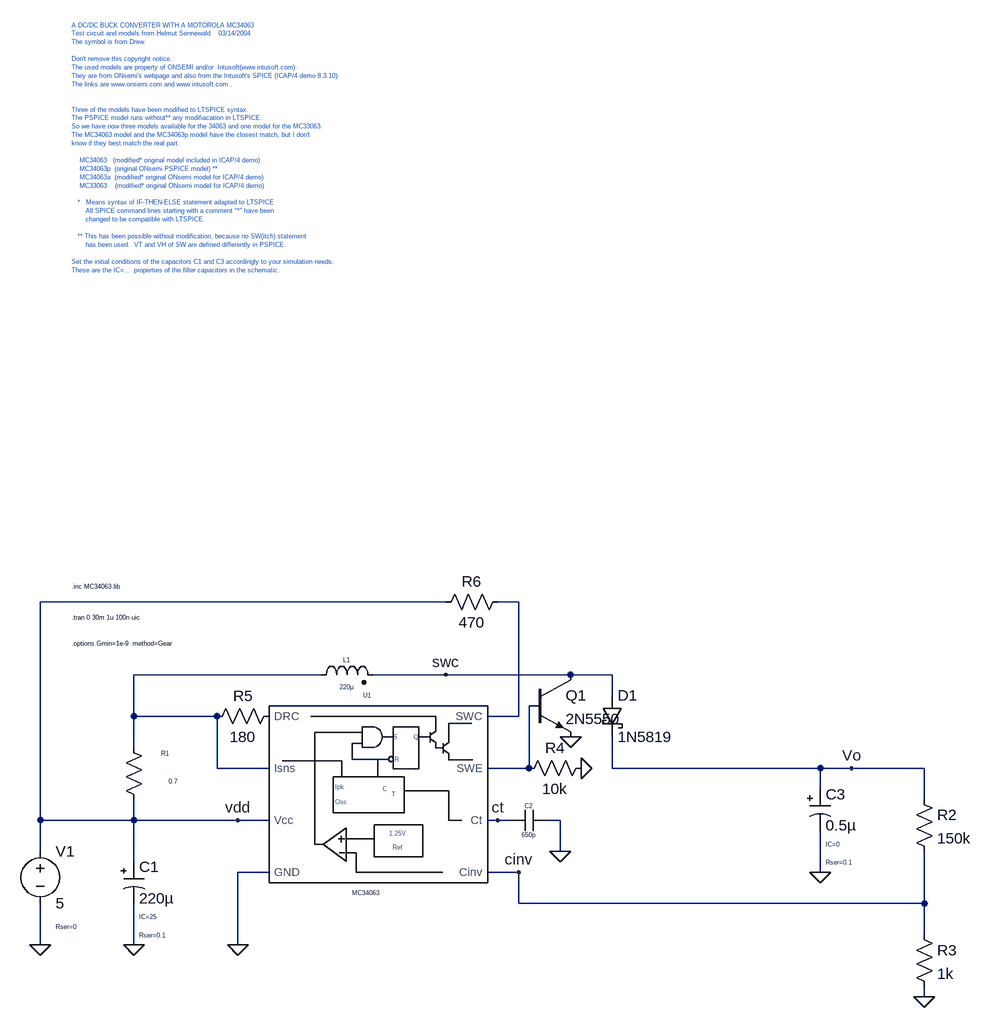
[diagram p0: schematic MC34063_buck.asc]
MC34063_buck.asc, the LTspice schematic file:
Version 4
SHEET 1 1572 772
WIRE 208 -48 -416 -48
WIRE 320 -48 288 -48
WIRE 16 64 -272 64
WIRE 208 64 96 64
WIRE 400 64 208 64
WIRE 464 64 400 64
WIRE 464 96 464 64
WIRE -272 128 -272 64
WIRE -144 128 -272 128
WIRE 320 128 320 -48
WIRE 320 128 272 128
WIRE -272 176 -272 128
WIRE -144 208 -144 128
WIRE -64 208 -144 208
WIRE 336 208 336 112
WIRE 336 208 272 208
WIRE 464 208 464 160
WIRE 784 208 464 208
WIRE 832 208 784 208
WIRE 944 208 832 208
WIRE 784 240 784 208
WIRE 944 256 944 208
WIRE -416 288 -416 -48
WIRE -272 288 -272 256
WIRE -272 288 -416 288
WIRE -112 288 -272 288
WIRE -64 288 -112 288
WIRE 288 288 272 288
WIRE 304 288 288 288
WIRE 384 288 368 288
WIRE -416 336 -416 288
WIRE 384 336 384 288
WIRE -272 352 -272 288
WIRE -64 368 -112 368
WIRE 320 368 272 368
WIRE 784 368 784 304
WIRE 320 416 320 368
WIRE 944 416 944 336
WIRE 944 416 320 416
WIRE 944 464 944 416
WIRE -416 480 -416 416
WIRE -272 480 -272 416
WIRE -112 480 -112 368
WIRE 944 560 944 544
FLAG -416 480 0
FLAG -272 480 0
FLAG 384 336 0
FLAG 784 368 0
FLAG 832 208 Vo
FLAG 944 560 0
FLAG -112 480 0
FLAG 288 288 ct
FLAG -112 288 vdd
FLAG 320 368 cinv
FLAG 208 64 swc
FLAG 400 160 0
FLAG 416 208 0
SYMBOL voltage -416 320 R0
WINDOW 123 0 0 Left 0
WINDOW 39 24 132 Left 0
SYMATTR SpiceLine Rser=0
SYMATTR InstName V1
SYMATTR Value 5
SYMBOL res -256 272 R180
WINDOW 0 -39 87 Left 0
WINDOW 3 -52 44 Left 0
SYMATTR InstName R1
SYMATTR Value 0.7
SYMBOL cap 304 304 R270
WINDOW 0 32 32 VTop 0
WINDOW 3 0 32 VBottom 0
SYMATTR InstName C2
SYMATTR Value 650p
SYMBOL schottky 448 96 R0
SYMATTR InstName D1
SYMATTR Value 1N5819
SYMATTR Description Diode
SYMATTR Type diode
SYMBOL ind2 0 80 R270
WINDOW 0 32 56 VTop 0
WINDOW 3 4 56 VBottom 0
SYMATTR InstName L1
SYMATTR Value 220µ
SYMATTR SpiceLine Rser=0.5
SYMATTR Type ind
SYMBOL res 928 240 R0
SYMATTR InstName R2
SYMATTR Value 150k
SYMBOL res 928 448 R0
SYMATTR InstName R3
SYMATTR Value 1k
SYMBOL polcap 768 240 R0
WINDOW 39 24 113 Left 0
WINDOW 40 24 85 Left 0
SYMATTR SpiceLine Rser=0.1
SYMATTR SpiceLine2 IC=0
SYMATTR InstName C3
SYMATTR Value 0.5µ
SYMBOL polcap -288 352 R0
WINDOW 39 24 113 Left 0
WINDOW 40 24 85 Left 0
SYMATTR SpiceLine Rser=0.1
SYMATTR SpiceLine2 IC=25
SYMATTR InstName C1
SYMATTR Value 220µ
SYMBOL mc34063 176 224 R0
SYMATTR InstName U1
SYMBOL res -48 112 R90
WINDOW 0 0 56 VBottom 2
WINDOW 3 32 56 VTop 2
SYMATTR InstName R5
SYMATTR Value 180
SYMBOL res 304 -64 R90
WINDOW 0 0 56 VBottom 2
WINDOW 3 32 56 VTop 2
SYMATTR InstName R6
SYMATTR Value 470
SYMBOL npn 336 64 R0
SYMATTR InstName Q1
SYMATTR Value 2N5550
SYMBOL res 432 192 R90
WINDOW 0 0 56 VBottom 2
WINDOW 3 32 56 VTop 2
SYMATTR InstName R4
SYMATTR Value 10k
TEXT -368 -24 Left 0 !.tran 0 30m 1u 100n uic
TEXT -368 -72 Left 0 !.inc MC34063.lib
TEXT -368 16 Left 0 !.options Gmin=1e-9  method=Gear
TEXT -368 -936 Left 0 ;A DC/DC BUCK CONVERTER WITH A MOTOROLA MC34063\nTest circuit and models from Helmut Sennewald    03/14/2004\nThe symbol is from Drew.\n \nDon't remove this copyright notice.\nThe used models are property of ONSEMI and/or  Intusoft(www.intusoft.com).\nThey are from ONsemi's webpage and also from the Intusoft's SPICE (ICAP/4 demo 8.3.10).\nThe links are www.onsemi.com and www.intusoft.com .\n \n \nThree of the models have been modified to LTSPICE syntax.\nThe PSPICE model runs without** any modifiacation in LTSPICE.\nSo we have now three models available for the 34063 and one model for the MC33063. \nThe MC34063 model and the MC34063p model have the closest match, but I don't\nknow if they best match the real part.\n \n    MC34063   (modified* original model included in ICAP/4 demo)\n    MC34063p  (original ONsemi PSPICE model) **\n    MC34063a  (modified* original ONsemi model for ICAP/4 demo)\n    MC33063    (modified* original ONsemi model for ICAP/4 demo) \n \n   *   Means syntax of IF-THEN-ELSE statement adapted to LTSPICE\n       All SPICE command lines starting with a comment "*" have been \n       changed to be compatible with LTSPICE. \n      \n   ** This has been possible without modification, because no SW(itch) statement \n       has been used.  VT and VH of SW are defined differently in PSPICE.\n \nSet the initial conditions of the capacitors C1 and C3 accordingly to your simulation needs.\nThese are the IC=...  properties of the filter capacitors in the schematic.

The netlist it stands for:
* MC34063_buck.asc
V1 vdd 0 5 Rser=0
R1 vdd N002 0.7
C2 ct 0 650p
D1 swc Vo 1N5819
L1 N002 swc 220µ Rser=0.5
R2 Vo cinv 150k
R3 cinv 0 1k
C3 Vo 0 0.5µ Rser=0.1 IC=0
C1 vdd 0 220µ Rser=0.1 IC=25
XU1 N001 N003 ct 0 cinv vdd N002 P001 MC34063  ; pins SWC SWE Ct GND Cinv Vcc Isns DRC
R5 P001 N002 180
R6 N001 vdd 470
Q1 swc N003 0 0 2N5550
R4 0 N003 10k
.model D D
.lib standard.dio
.model NPN NPN
.model PNP PNP
.lib standard.bjt
.tran 0 30m 1u 100n uic
.inc MC34063.lib
.options Gmin=1e-9  method=Gear
* A DC/DC BUCK CONVERTER WITH A MOTOROLA MC34063
* Test circuit and models from Helmut Sennewald    03/14/2004
* The symbol is from Drew.
* Don't remove this copyright notice.
* The used models are property of ONSEMI and/or  Intusoft(www.intusoft.com).
* They are from ONsemi's webpage and also from the Intusoft's SPICE (ICAP/4 demo 8.3.10).
* The links are www.onsemi.com and www.intusoft.com .
* Three of the models have been modified to LTSPICE syntax.
* The PSPICE model runs without** any modifiacation in LTSPICE.
* So we have now three models available for the 34063 and one model for the MC33063.
* The MC34063 model and the MC34063p model have the closest match, but I don't
* know if they best match the real part.
*     MC34063   (modified* original model included in ICAP/4 demo)
*     MC34063p  (original ONsemi PSPICE model) **
*     MC34063a  (modified* original ONsemi model for ICAP/4 demo)
*     MC33063    (modified* original ONsemi model for ICAP/4 demo)
*    *   Means syntax of IF-THEN-ELSE statement adapted to LTSPICE
*        All SPICE command lines starting with a comment "*" have been
*        changed to be compatible with LTSPICE.
*    ** This has been possible without modification, because no SW(itch) statement
*        has been used.  VT and VH of SW are defined differently in PSPICE.
* Set the initial conditions of the capacitors C1 and C3 accordingly to your simulation needs.
* These are the IC=...  properties of the filter capacitors in the schematic.
.backanno
.end